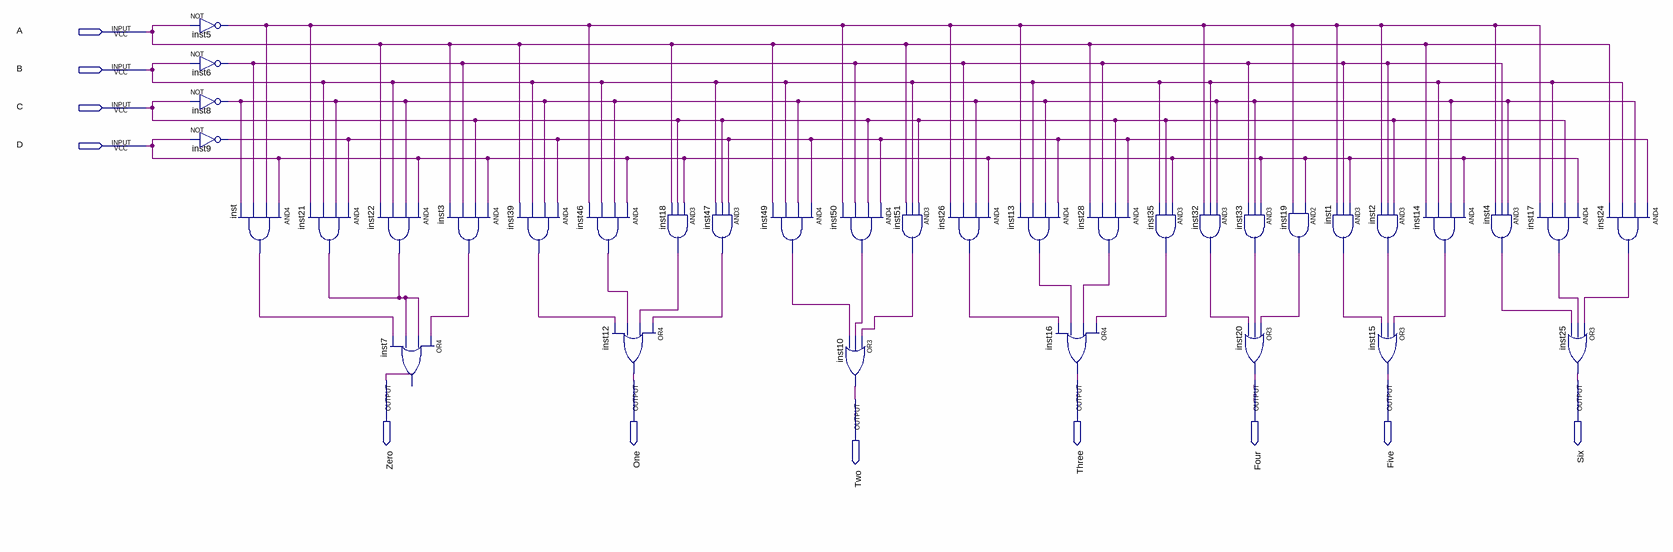
[diagram p0: schematic sheet]
// Quartus schematic secondsevenseg.bdf as structural Verilog: 35 symbols, 11 pins
module secondsevenseg (
  input  A,
  input  B,
  input  C,
  input  D,
  output Zero,
  output One,
  output Three,
  output Four,
  output Five,
  output Six,
  output Two
);

  wire inst1_out, inst2_out, inst3_out, inst4_out, inst5_out, inst6_out, inst8_out, inst9_out, inst13_out,
       inst14_out, inst17_out, inst18_out, inst19_out, inst21_out, inst24_out, inst26_out, inst28_out,
       inst32_out, inst33_out, inst35_out, inst39_out, inst46_out, inst47_out, inst49_out, inst50_out,
       inst51_out, inst_out;

  not inst5 (inst5_out, A);
  not inst6 (inst6_out, B);
  not inst8 (inst8_out, C);
  not inst9 (inst9_out, D);
  and inst (inst_out, D, inst5_out, inst6_out, inst8_out);
  and inst21 (inst21_out, inst9_out, inst8_out, B, inst5_out);
  and inst22 (inst21_out, D, inst8_out, B, A);
  or inst7 (Zero, inst3_out, inst21_out, inst21_out, inst_out);
  and inst3 (inst3_out, D, C, inst6_out, A);
  and inst39 (inst39_out, inst9_out, inst8_out, B, A);
  and inst46 (inst46_out, D, inst8_out, B, inst5_out);
  or inst12 (One, inst47_out, inst18_out, inst46_out, inst39_out);
  and inst47 (inst47_out, inst9_out, C, B);
  and inst18 (inst18_out, D, C, A);
  and inst49 (inst49_out, inst9_out, inst8_out, B, A);
  and inst50 (inst50_out, inst9_out, C, inst6_out, inst5_out);
  or inst10 (Two, inst51_out, inst50_out, inst49_out);
  and inst51 (inst51_out, C, B, A);
  and inst26 (inst26_out, D, inst8_out, inst6_out, inst5_out);
  and inst13 (inst13_out, inst9_out, inst8_out, B, inst5_out);
  or inst16 (Three, inst35_out, inst28_out, inst13_out, inst26_out);
  and inst28 (inst28_out, inst9_out, C, inst6_out, A);
  and inst35 (inst35_out, D, C, B);
  and inst32 (inst32_out, inst8_out, B, inst5_out);
  and inst33 (inst33_out, D, inst8_out, inst6_out);
  or inst20 (Four, inst19_out, inst33_out, inst32_out);
  and inst19 (inst19_out, D, inst5_out);
  and inst1 (inst1_out, D, inst6_out, inst5_out);
  and inst14 (inst14_out, D, inst8_out, B, A);
  and inst2 (inst2_out, C, inst6_out, inst5_out);
  or inst15 (Five, inst14_out, inst2_out, inst1_out);
  and inst4 (inst4_out, inst8_out, inst6_out, inst5_out);
  and inst17 (inst17_out, D, C, B, inst5_out);
  or inst25 (Six, inst24_out, inst17_out, inst4_out);
  and inst24 (inst24_out, inst9_out, inst8_out, B, A);
endmodule
